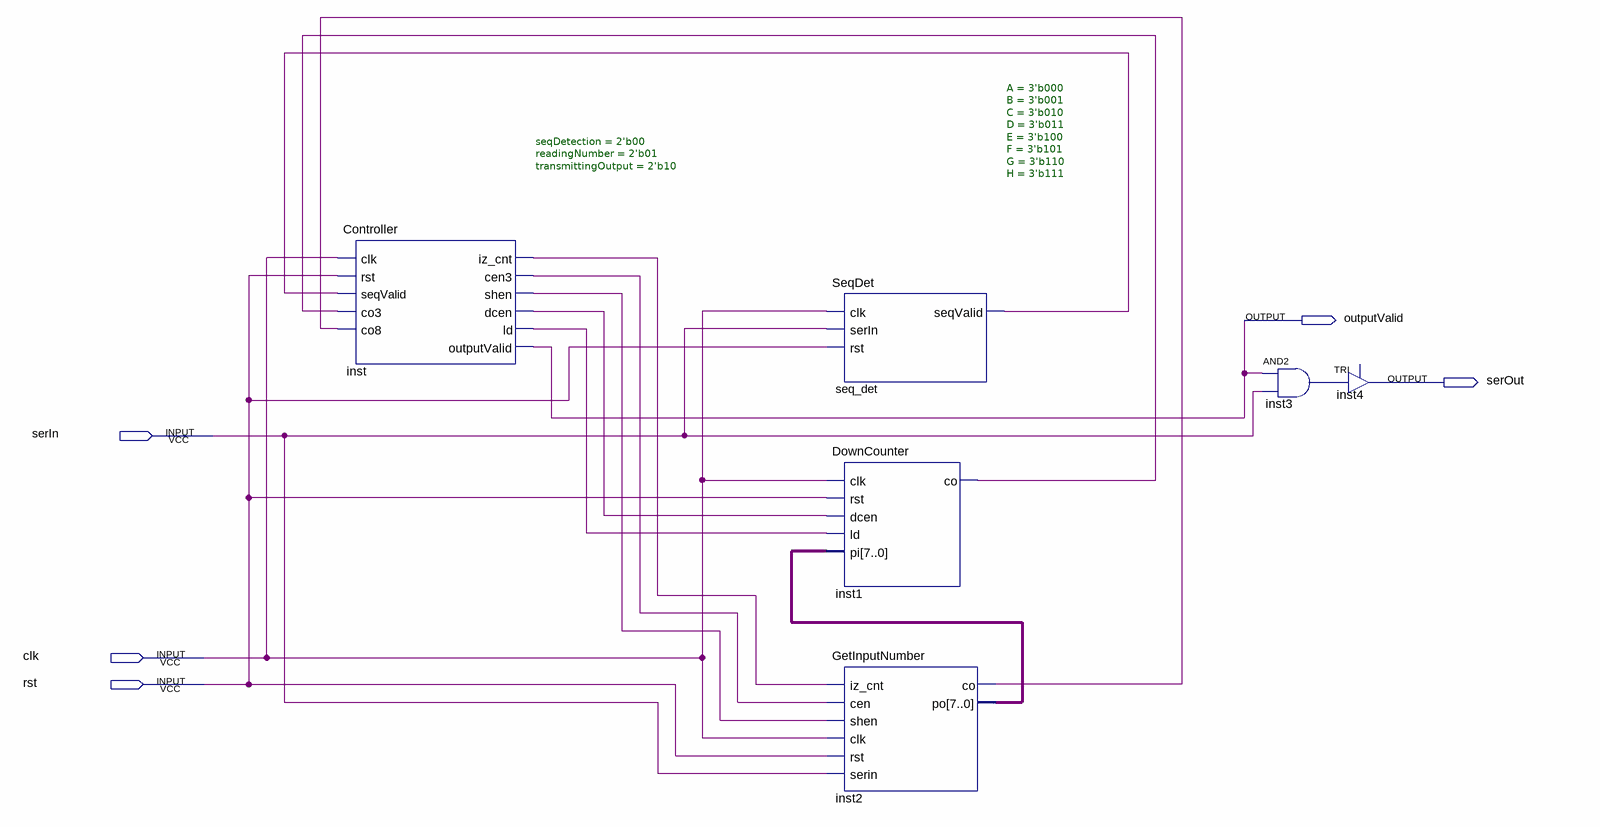
[diagram p0: schematic sheet]
// Quartus schematic MainCircuit.bdf as structural Verilog: 6 symbols, 5 pins
module MainCircuit (
  input  serIn,
  input  clk,
  input  rst,
  output outputValid,
  output serOut
);

  wire inst1_co, inst2_co, inst3_out, inst_cen3, inst_dcen, inst_iz_cnt, inst_ld, inst_shen, seq_det_seqvalid;
  wire [7:0] inst2_po;

  Controller #(.seqDetection(2'b00), .readingNumber(2'b01), .transmittingOutput(2'b10)) inst (
    .clk(clk), .rst(rst), .seqValid(seq_det_seqvalid), .co3(inst1_co), .co8(inst2_co), .iz_cnt(inst_iz_cnt),
    .cen3(inst_cen3), .shen(inst_shen), .dcen(inst_dcen), .ld(inst_ld), .outputValid(outputValid));
  SeqDet #(.A(3'b000), .B(3'b001), .C(3'b010), .D(3'b011), .E(3'b100), .F(3'b101), .G(3'b110), .H(3'b111)) seq_det (
    .clk(clk), .serIn(serIn), .rst(rst), .seqValid(seq_det_seqvalid));
  DownCounter inst1 (.clk(clk), .rst(rst), .dcen(inst_dcen), .ld(inst_ld), .pi(inst2_po), .co(inst1_co));
  GetInputNumber inst2 (
    .iz_cnt(inst_iz_cnt), .cen(inst_cen3), .shen(inst_shen), .clk(clk), .rst(rst), .serin(serIn),
    .co(inst2_co), .po(inst2_po));
  and inst3 (inst3_out, outputValid, serIn);
  TRI inst4 (.IN(inst3_out), .OUT(serOut));  // open: OE
endmodule
